# EasyEDA Pro project ProPrj_WatcheRobot2.0openSource_2026-06-17.epro, schematic 反馈舵机STM32控制板原理图
Assembly Variant: Basic; Board Name: Board1; Create Date: 2026-06-17; Page Name: P1; Project Name: WatcheRobot2.0; Schematic Name: Schematic3; Update Date: 2026-06-17; Company: 嘉立创EDA; Page Size: A4; Version: V1.0
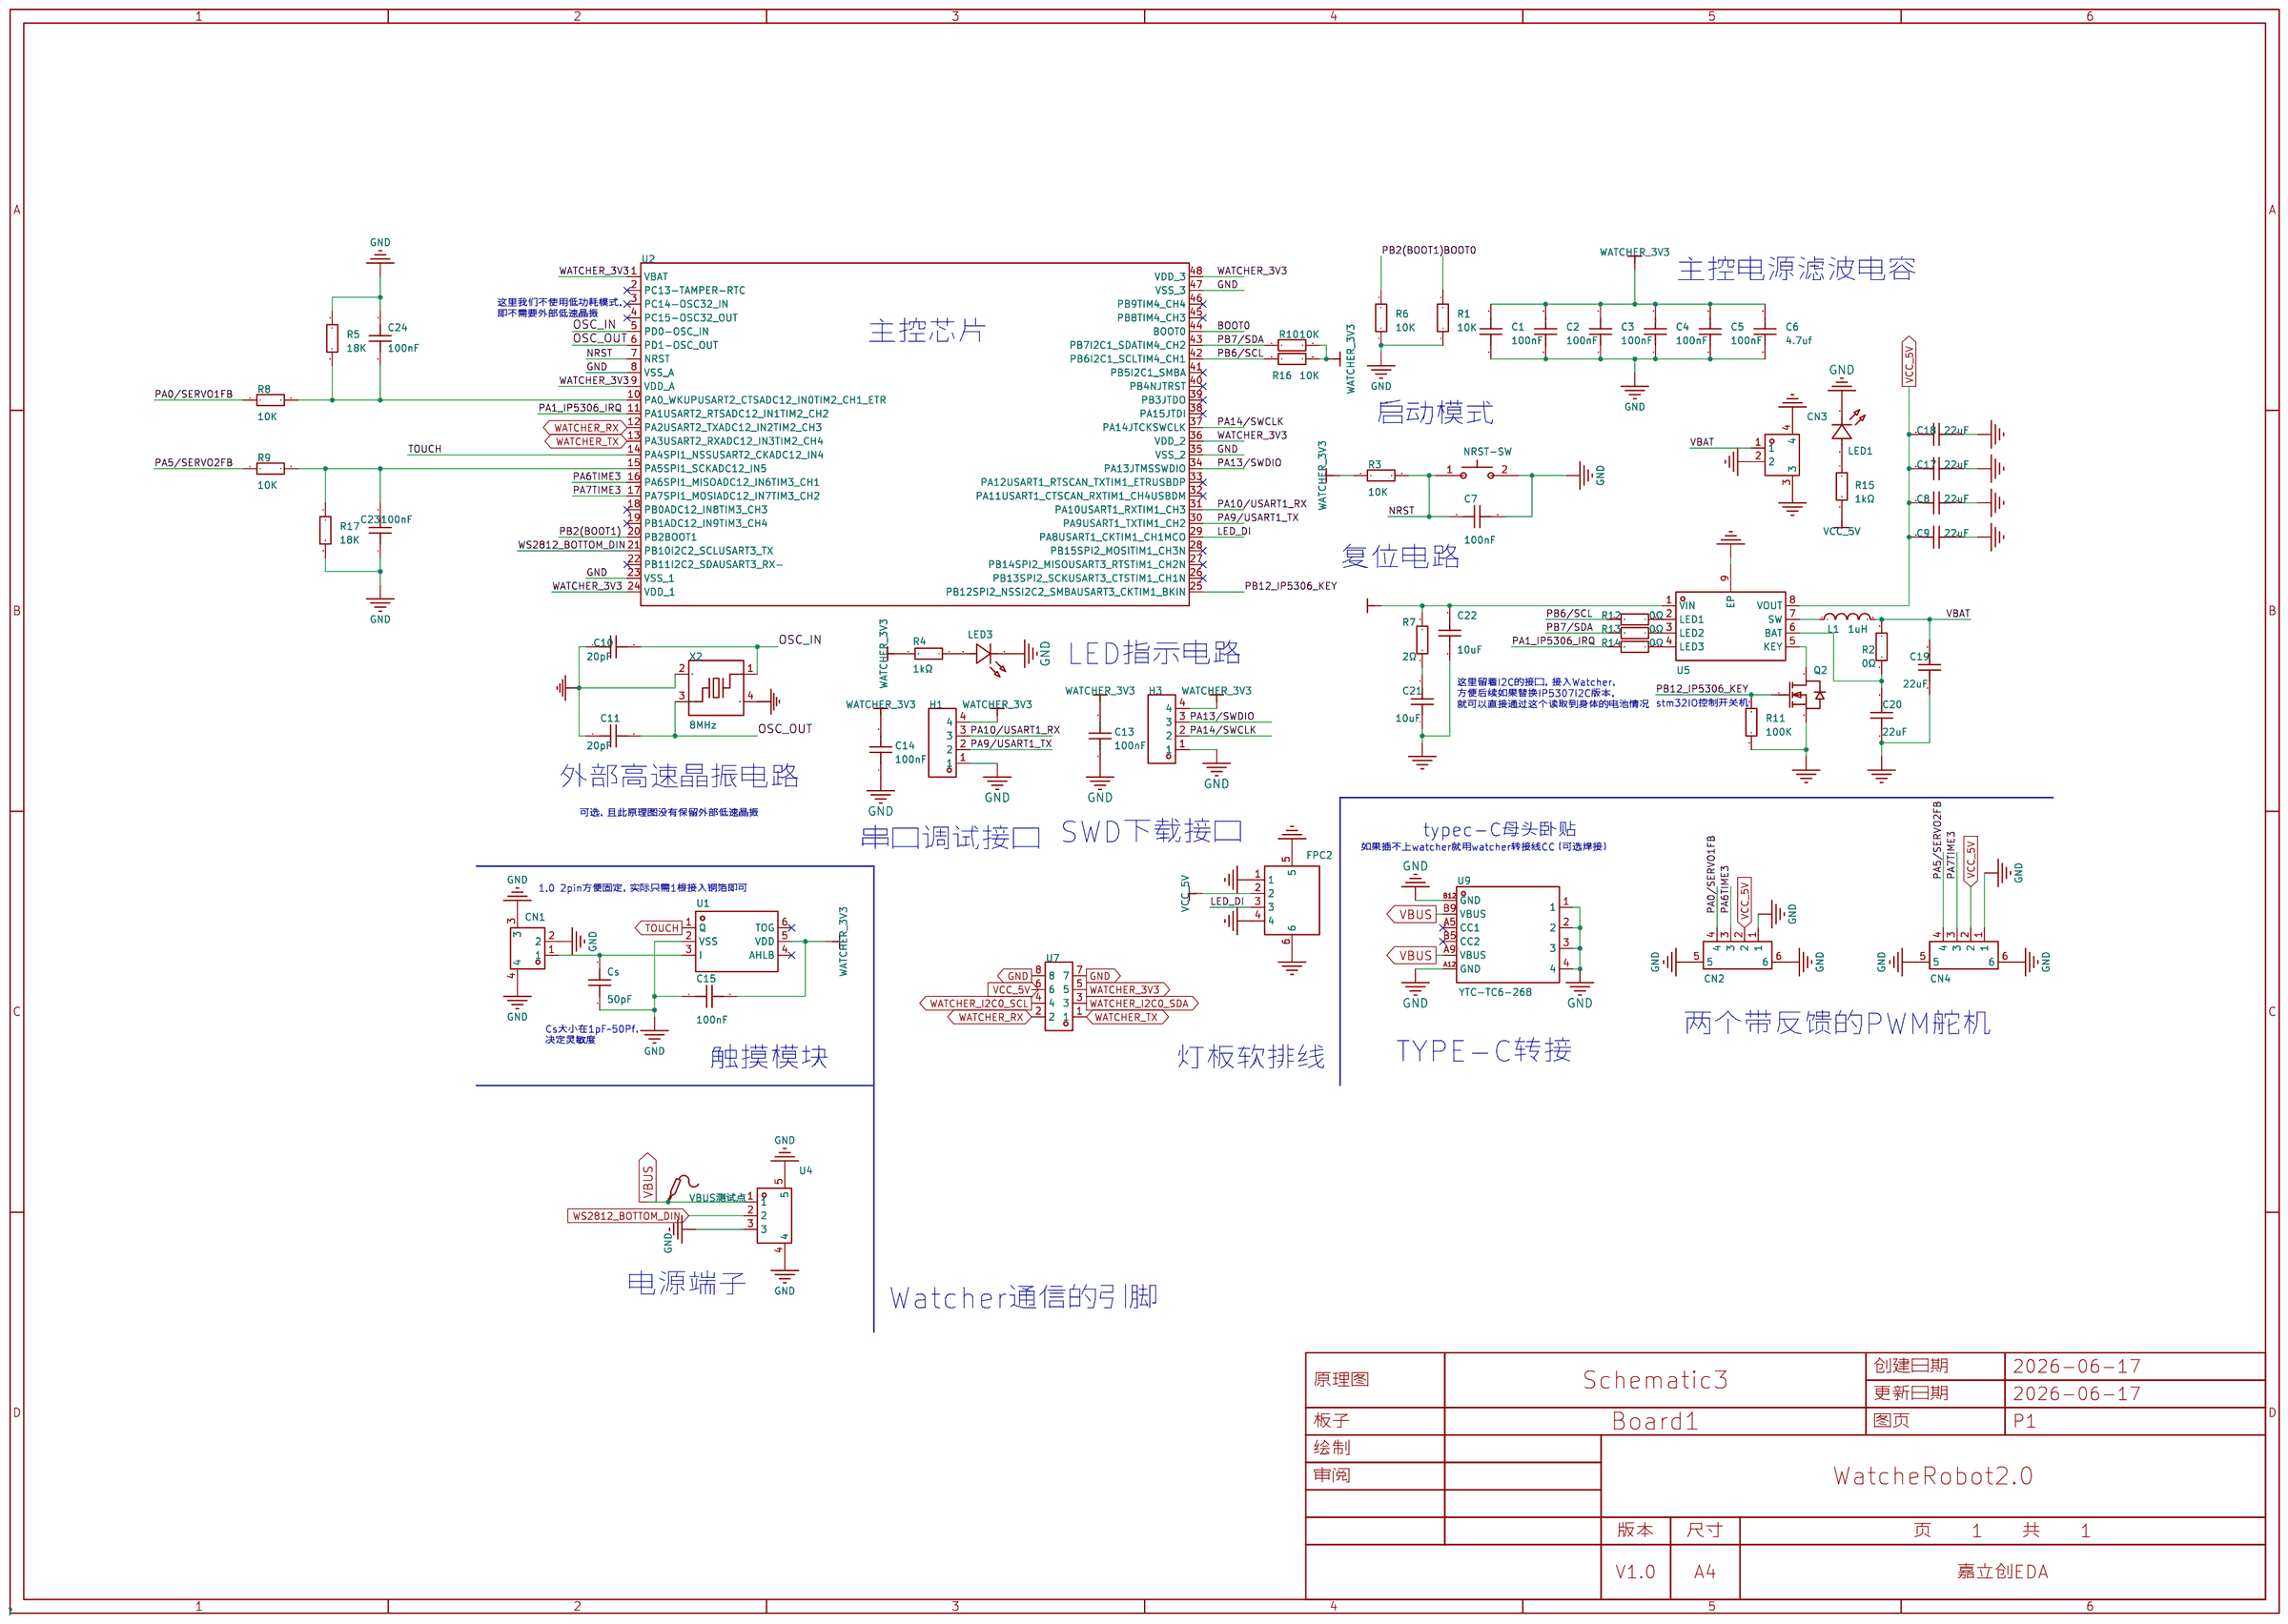
[diagram p3: schematic sheet]

## Parts
C1  100nF  [C0603]
C2  100nF  [C0603]
C3  100nF  [C0603]
C4  100nF  [C0603]
C5  100nF  [C0603]
C6  4.7uf  [C0603]
C7  100nF  [C0603]
C8  22uF  [C0603]
C9  22uF  [C0603]
C10  20pF  [C0603]
C11  20pF  [C0603]
C13  100nF  [C0603]
C14  100nF  [C0603]
C15  100nF  [C0603]
C17  22uF  [C0603]
C18  22uF  [C0603]
C19  22uF  [C0603]
C20  22uF  [C0603]
C21  10uF  [C0603]
C22  10uF  [C0603]
C23  100nF  [C0603]
C24  100nF  [C0603]
CN1  SH1.0mm立式  [CONN-SMD_2P-P1.00_HC-1.0-2PLT]
CN2  SH-MX1.25-4PLT  [CONN-SMD_4P-P1.25_SH-MX1.25-4PLT]
CN3  SH1.0mm立式  [CONN-SMD_2P-P1.00_HC-1.0-2PLT]
CN4  SH-MX1.25-4PLT  [CONN-SMD_4P-P1.25_SH-MX1.25-4PLT]
Cs  50pF  [C0603]
FPC2  FPC4_1mm(下接)  [FPC-SMD_4P-P1.00_C9900022405]
H1  PZ254V-11-04P  [HDR-TH_4P-P2.54-V-M]
H3  PZ254V-11-04P  [HDR-TH_4P-P2.54-V-M]
L1  1uH  [IND-SMD_L4.4-W4.2]
LED1  XL-1608UGC-04  [LED0603-RD_GREEN]
LED3  XL-1608UGC-04  [LED0603-RD_GREEN]
NRST-SW  1TS002C-2300-4300-CT  [SW-SMD_L6.0-W3.5-LS8.0-EH]
Q2  2N7002  [SOT-23-3_L2.9-W1.3-P1.90-LS2.4-BR]
R1  10K  [R0603]
R2  0Ω  [R0603]
R3  10K  [R0603]
R4  1kΩ  [R0402]
R5  18K  [R0603]
R6  10K  [R0603]
R7  2Ω  [R0603]
R8  10K  [R0603]
R9  10K  [R0603]
R10  10K  [R0603]
R11  100K  [R0603]
R12  0Ω  [R0603]
R13  0Ω  [R0603]
R14  0Ω  [R0603]
R15  1kΩ  [R0402]
R16  10K  [R0603]
R17  18K  [R0603]
U1  TTP223E-BA6  [SOT-23-6_L2.9-W1.6-P0.95-LS2.8-BR]
U2  STM32F103CBT6  [LQFP-48_L7.0-W7.0-P0.50-LS9.0-BL]
U4  ZX-SH1.0-3PLT  [CONN-SMD_3P-P1.00_HDGC_HDGC1002WV-S-3P]
U5  IP5306  [ESOP-8_L4.9-W3.9-P1.27-LS6.0-BL-EP]
U7  PZ2.54-2*4  [HDR-TH_8P-P2.54-V-M-R2-C4-S2.54]
U9  YTC-TC6-268  [TYPE-C-SMD_YIYUAN_YTC-TC6-268]
VBUS测试点  -  [Test-Point-0.5mm]
X2  8MHz  [CRYSTAL-SMD_4P-L3.2-W2.5-BL]

## Library data of the parts
C1-C7 C10 C11 C13-C15 C23 C24 = CAP_0603: Supplier Footprint: 0603
C8 C9 C17-C20 = CGA0603X5R226M100JT: 容值:22uF;精度:±20%;额定电压:10V;温度系数:X5R;; LCSC Part Name: 22uF ±20% 10V; Supplier Part: C6119863; Manufacturer: HRE(芯声); Supplier Footprint: 0603; JLCPCB Part Class: 扩展库; Datasheet: https://item.szlcsc.com/datasheet/CGA0603X5R226M100JT/7062569.html; Supplier: LCSC; Tolerance: ±20%; Voltage Rating: 10V; Temperature Coefficient: X5R; Check: false
C21 C22 = CGA0603X5R106K100JT: 容值:10uF;精度:±10%;额定电压:10V;温度系数:X5R;; LCSC Part Name: 10uF ±10% 10V; Supplier Part: C6119842; Manufacturer: HRE(芯声); Supplier Footprint: 0603; JLCPCB Part Class: 扩展库; Datasheet: https://item.szlcsc.com/datasheet/CGA0603X5R106K100JT/7062548.html; Supplier: LCSC; Tolerance: ±10%; Voltage Rating: 10V; Temperature Coefficient: X5R; Check: false
CN1 CN3 = SH1.0mm立式: Supplier Part: C9900005667; Supplier Footprint: SH1.0-2P; JLCPCB Part Class: Extended Part; Supplier: LCSC
CN2 CN4 = SH-MX1.25-4PLT: 插针结构:1x4P;间距:1.25mm;安装方式:立贴;总PIN数:4P;排数:1;每排PIN数:4;额定电流:1A;触头材质:黄铜;触头镀层:锡;工作温度:-25℃~+70℃;; LCSC Part Name: 1x4P 间距:1.25mm 立贴; Supplier Part: C53477387; Manufacturer: SHOU HAN(首韩); Supplier Footprint: SMD,P=1.25mm; JLCPCB Part Class: Extended Part; Datasheet: https://item.szlcsc.com/datasheet/SH-MX1.25-4PLT/56654835.html; Supplier: LCSC; Pins Structure: 1x4P; Pitch: 1.25mm; Mounting Type: 立贴; Number of Pins: 4P; Number of Rows: 1; Number of PINs Per Row: 4; Current Rating: 1A; Contact Material: 黄铜; Contact Plating: 锡; Operating Temperature: -25℃~+70℃; Voltage Rating: 125V; Plastic Material: LCP; Flame Retardant Rating: UL94V-0; Z-Height of the Board: 4.65mm; X-Length of Bottom Edge on Board (Spacing Line): 10mm; Y-Width of Bottom Edge on Board: 4.3mm
Cs = TCC0603COG500J500CT: 容值:50pF;精度:±5%;额定电压:50V;温度系数:C0G;; LCSC Part Name: 50pF ±5% 50V; Supplier Part: C376792; Manufacturer: CCTC(三环); Supplier Footprint: 0603; JLCPCB Part Class: Extended Part; Datasheet: https://item.szlcsc.com/datasheet/TCC0603COG500J500CT/349151.html; Supplier: LCSC; Tolerance: ±5%; Voltage Rating: 50V; Temperature Coefficient: C0G
FPC2 = FPC4_1mm(下接): Supplier Part: C9900022405; Supplier Footprint: FPC-SMD_4P-P1.00; JLCPCB Part Class: Extended Part; Supplier: LCSC
H1 H3 = PZ254V-11-04P: 插针结构:1x4P;间距:2.54mm;行距:-;圆针/方针:方针;安装方式:直插;排数:单排;总PIN位数:4P;额定电流:3A;额定电压:250V;配合针长度:6mm;塑高:2.5mm;端接针长度:3mm;触头材质:-;工作温度:-40℃~+105℃;颜色:黑色;; LCSC Part Name: 1x4P 间距:2.54mm 方针 直插; Supplier Part: C2691448; Manufacturer: XFCN(兴飞); Supplier Footprint: 插件,P=2.54mm; JLCPCB Part Class: Extended Part; Datasheet: https://item.szlcsc.com/datasheet/PZ254V-11-04P/2801085.html; Supplier: LCSC; Pin Structure: 1x4P; Pitch: 2.54mm; Circluar Pins/Square Pins: 方针; Mounting Type: 直插; Number of Rows: 单排; Number of Pins: 4P; Current Rating: 3A; Voltage Rating (Max): 250V; Length of Mating Pin: 6mm; Insulation Height: 2.5mm; Length of End Connection Pin: 3mm; Operating Temperature: -40℃~+105℃; Color: 黑色
L1 = FXL0420-1R0-M: 电感值:1uH;精度:±20%;额定电流:6A;饱和电流(Isat):7A;类型:一体成型电感;; LCSC Part Name: 1uH ±20% 7A; Supplier Part: C167203; Manufacturer: cjiang(长江微电); Supplier Footprint: SMD,4.2x4.4mm; JLCPCB Part Class: 扩展库; Datasheet: https://atta.szlcsc.com/upload/public/pdf/source/20240426/3189EA8206330E2108542F9E34E540E7.pdf; Supplier: LCSC; Tolerance: ±20%; Rated Current: 6A; Saturation Current (Isat): 7A; DC Resistance (DCR): 27mΩ; Type: 一体成型电感; Check: false
LED1 LED3 = XL-1608UGC-04: 灯头类型:-;发光颜色:翠绿色;正向压降(Vf):3.3V;功率:70mW;正向电流:20mA;波长:515nm~535nm;二极管配置:独立二极管;透镜颜色:无色透明透镜;色温:-;发光强度:810mcd;发光角度:120°;载带方式:正贴;工作温度:-40℃~+85℃;; LCSC Part Name: 0603翠绿贴片式发光二极管; Supplier Part: C965804; Manufacturer: XINGLIGHT(成兴光); Supplier Footprint: 0603; JLCPCB Part Class: Extended Part; Datasheet: https://item.szlcsc.com/datasheet/XL-1608UGC-04/1051413.html; Supplier: LCSC; Illumination Color: 翠绿色; Voltage - Forward(Vf): 3.3V; Power(Watts): 70mW; Forward Current: 20mA; Wavelength - Dominant: 515nm~535nm; Peak Wavelength: 525nm; Diode Configuration: 独立二极管; Lens Color: 无色透明透镜; Luminous Intensity: 810mcd; Viewing Angle: 120°; Mounting Style: 正贴; Operating Temperature: -40℃~+85℃
NRST-SW = 1TS002C-2300-4300-CT: 电路结构:单刀单掷;按钮形状:矩形按钮;作用力:2.3N;安装方式:立贴;开关长度:6mm;开关宽度:3.5mm;开关高度:4.3mm;带支架:不带支架;触点电流:50mA;额定电压:12V;带灯:无;工作寿命:3万次;; LCSC Part Name: 6*3.5*4.3mm 立贴 轻触开关; Supplier Part: C319340; Manufacturer: HYP(鸿源精密); Supplier Footprint: SMD,6x3.5mm; JLCPCB Part Class: Extended Part; Datasheet: https://item.szlcsc.com/datasheet/1TS002C-2300-4300-CT/300339.html; Supplier: LCSC; Circuit: 单刀单掷; Actuator Style: 矩形按钮; Operating Force: 2.3N; Mounting Type: 立贴; Length: 6mm; Width: 3.5mm; Switch Height: 4.3mm; with Bracket: 不带支架; Contact Current: 50mA; Voltage Rating: 12V; Actuator/Cap Color: 白色; With Lamp: 无; Termination Style: 鸥翼型; Life: 3万次; Operating Temperature: -40℃~+90℃
Q2 = 2N7002: 数量:1个N沟道;漏源电压(Vdss):60V;连续漏极电流(Id):115mA;导通电阻(RDS(on)):7.5Ω@10V,500mA;耗散功率(Pd):200mW;阈值电压(Vgs(th)):2.5V;; LCSC Part Name: 1个N沟道 耐压:60V 电流:115mA; Supplier Part: C727149; Manufacturer: TWGMC(迪嘉); Supplier Footprint: SOT-23; JLCPCB Part Class: Extended Part; Datasheet: https://item.szlcsc.com/datasheet/2N7002/774254.html; Supplier: LCSC; Number: 1个N沟道; Drain to Source Voltage: 60V; Current - Continuous Drain(Id): 115mA; RDS(on): 7.5Ω@10V,500mA; Pd - Power Dissipation: 200mW; Gate Threshold Voltage (Vgs(th)): 2.5V; Input Capacitance(Ciss): 50pF@25V; Reverse Transfer Capacitance (Crss@Vds): 5pF@25V; Operating Temperature: -55℃~+150℃
R1 R3 R5 R6 R8-R11 R16 R17 = Res_0603: Supplier Footprint: 0603
R2 R12-R14 = 0603WAF0000T5E: 电阻类型:厚膜电阻;阻值:0Ω;精度:±1%;功率:100mW;工作电压:75V;温度系数:-;; LCSC Part Name: 0Ω ±1% 100mW 厚膜电阻; Supplier Part: C21189; Manufacturer: UNI-ROYAL(厚声); Supplier Footprint: 0603; JLCPCB Part Class: 基础库; Datasheet: https://item.szlcsc.com/datasheet/0603WAF0000T5E/21903.html; Supplier: LCSC; Type: 厚膜电阻; Tolerance: ±1%; Power(Watts): 100mW; Voltage-Supply(Max): 75V; Operating Temperature: -55℃~+155℃; Check: false
R4 R15 = 0402WGF1001TCE: 电阻类型:厚膜电阻;阻值:1kΩ;精度:±1%;功率:62.5mW;最大工作电压:50V;温度系数:±100ppm/℃;; LCSC Part Name: 1kΩ ±1% 62.5mW 厚膜电阻; Supplier Part: C11702; Manufacturer: UNI-ROYAL(厚声); Supplier Footprint: 0402; JLCPCB Part Class: 基础库; Datasheet: https://atta.szlcsc.com/upload/public/pdf/source/20200306/C422600_1E6D84923E4A46A82E41ADD87F860B5C.pdf; Supplier: LCSC; Type: 厚膜电阻; Tolerance: ±1%; Power(Watts): 62.5mW; Overload Voltage (Max): 50V; Temperature Coefficient: ±100ppm/℃; Operating Temperature Range: -55℃~+155℃
R7 = 0603WAF200KT5E: 电阻类型:厚膜电阻;阻值:2Ω;精度:±1%;功率:100mW;工作电压:75V;温度系数:±200ppm/℃;; LCSC Part Name: 2Ω ±1% 100mW 厚膜电阻; Supplier Part: C22977; Manufacturer: UNI-ROYAL(厚声); Supplier Footprint: 0603; JLCPCB Part Class: 基础库; Datasheet: https://item.szlcsc.com/datasheet/0603WAF200KT5E/23704.html; Supplier: LCSC; Type: 厚膜电阻; Tolerance: ±1%; Power(Watts): 100mW; Voltage-Supply(Max): 75V; Temperature Coefficient: ±200ppm/℃; Operating Temperature: -55℃~+155℃; Check: false
U1 = TTP223E-BA6: 单按键触摸感应开关; LCSC Part Name: 停产; Supplier Part: C129457; Manufacturer: TONTEK(通泰); Supplier Footprint: SOT-23-6; JLCPCB Part Class: Extended Part; Datasheet: https://atta.szlcsc.com/upload/public/pdf/source/20170914/C129457_1505360037116968239.pdf; Supplier: LCSC
U2 = STM32F103CBT6: CPU内核:ARM-M3;CPU最大主频:72MHz;应用领域:-;; LCSC Part Name: 主流增强型ARM Cortex-M3 MCU，具有128 KB Flash、72 MHz CPU、电机控制、USB和CAN; Supplier Part: C8304; Manufacturer: ST(意法半导体); Supplier Footprint: LQFP-48(7x7); JLCPCB Part Class: Extended Part; Datasheet: https://item.szlcsc.com/datasheet/STM32F103CBT6/8796.html; Supplier: LCSC; CPU Core: ARM-M3; CPU Maximum Speed: 72MHz; Program Storage Size: 128KB; Program Memory Type: FLASH; Number of I/O: 37; ADC (Bit): 12bit; Voltage - Supply: 2V~3.6V
U4 = ZX-SH1.0-3PLT: 插针结构:1x3P;间距:1mm;安装方式:立贴;参考系列:SH;总PIN数:3P;排数:1;每排PIN数:3;行距:-;额定电流:1A;触头材质:黄铜;触头镀层:锡;工作温度:-40℃~+85℃;; LCSC Part Name: 1x3P 间距:1mm 立贴 系列:SH; Supplier Part: C7430452; Manufacturer: Megastar(兆星); Supplier Footprint: SMD,P=1mm; JLCPCB Part Class: Extended Part; Datasheet: https://item.szlcsc.com/datasheet/ZX-SH1.0-3PLT/8430321.html; Supplier: LCSC; Pins Structure: 1x3P; Pitch: 1mm; Mounting Type: 立贴; Reference Series: SH; Number of Pins: 3P; Number of Rows: 1; Number of PINs Per Row: 3; Current Rating: 1A; Contact Material: 黄铜; Contact Plating: 锡; Operating Temperature: -40℃~+85℃; Voltage Rating: 50V; Plastic Material: LCP; Supplementary Features: 辅助焊脚; Color: 米色; Z-Height of the Board: 4.4mm; X-Length of Bottom Edge on Board (Spacing Line): 5.35mm; Y-Width of Bottom Edge on Board: 3.05mm
U5 = IP5306: 2.1A充电2.4A放电高集成度移动电源SOC; Supplier Part: C181692; Manufacturer: INJOINIC(英集芯); Supplier Footprint: ESOP-8; JLCPCB Part Class: 扩展库; Datasheet: https://atta.szlcsc.com/upload/public/pdf/source/20190627/C384572_9925B3DDC4041BC6108E5AB46A2A0AB1.pdf; Supplier: LCSC
U7 = PZ2.54-2*4: 插针结构:2x4P;间距:2.54mm;行距:2.54mm;圆针/方针:方针;安装方式:直插;排数:双排;总PIN位数:8P;额定电流:2.5A;配合针长度:6mm;塑高:2.54mm;端接针长度:3mm;触头材质:黄铜;触头镀层:金;工作温度:-40℃~+105℃;; LCSC Part Name: 2x4P 间距:2.54mm 方针 直插; Supplier Part: C5156676; Manufacturer: ZHOURI(洲日); Supplier Footprint: 插件,P=2.54mm; JLCPCB Part Class: Extended Part; Datasheet: https://item.szlcsc.com/datasheet/PZ2.54-2*4/5790845.html; Supplier: LCSC; Pin Structure: 2x4P; Pitch: 2.54mm; Row Spacing: 2.54mm; Circluar Pins/Square Pins: 方针; Mounting Type: 直插; Number of Rows: 双排; Number of Pins: 8P; Current Rating: 2.5A; Length of Mating Pin: 6mm; Insulation Height: 2.54mm; Length of End Connection Pin: 3mm; Contact Material: 黄铜; Contact Plating: 金; Operating Temperature: -40℃~+105℃
U9 = YTC-TC6-268: 连接器类型:Type-C;公母:母座;触点数量:6;; LCSC Part Name: Type-C 母座; Supplier Part: C5260484; Manufacturer: YIYUAN(怡远); Supplier Footprint: SMD; JLCPCB Part Class: 扩展库; Datasheet: https://atta.szlcsc.com/upload/public/pdf/source/20221115/94102468E8C367463F1D717839C68408.pdf; Supplier: LCSC; Connector Type: Type-C; Gender: 母座; Number of Contacts: 6
VBUS测试点 = Test-Point: Test Point 测试点
X2 = X32258MOB4SI: 晶振类型:贴片晶振;频率:8MHz;常温频差:±10ppm;负载电容:12pF;频率稳定度:±20ppm;; LCSC Part Name: YSX321SL 8MHZ 4P 3225 12PF ±10PPM -40~85℃ (±20PPM); Supplier Part: C2682775; Manufacturer: YXC(扬兴晶振); Supplier Footprint: SMD3225-4P; JLCPCB Part Class: Extended Part; Datasheet: https://item.szlcsc.com/datasheet/X32258MOB4SI/2777872.html; Supplier: LCSC; Type: 贴片晶振; Normal temperature Frequency Tolerance: ±10ppm; Load Capacitance: 12pF; Frequency Stability: ±20ppm; Equivalent Series Resistance(ESR): 150Ω; Operating Temperature: -40℃~+85℃

## Nets
GND: C1.1 C2.1 C3.1 C4.1 C5.1 C6.1 C7.2 C8.1 C9.1 C10.1 C11.1 C13.1 C14.1 C15.1 C17.1 C18.1 C19.1 C20.1 C21.1 C22.1 C23.1 C24.1 CN1.2 CN1.3 CN1.4 CN2.1 CN2.5 CN2.6 CN3.2 CN3.3 CN3.4 CN4.1 CN4.5 CN4.6 Cs.1 FPC2.1 FPC2.4 FPC2.5 FPC2.6 H1.1 H3.1 LED1.1(K) LED3.1(K) NRST-SW.2(B) Q2.2(S) R1.1 R5.1 R6.1 R11.1 R17.2 U1.2(VSS) U2.8(VSS_A) U2.23(VSS_1) U2.35(VSS_2) U2.47(VSS_3) U4.3 U4.4 U4.5 U5.9(EP) U7.7 U7.8 U9.1 U9.2 U9.3 U9.4 U9.A12(GND) U9.B12(GND) X2.2(GND) X2.4(GND)
VBAT: C19.2 CN3.1 L1.2 R2.2
VBUS: C22.2 R7.2 U4.1 U5.1(VIN) U9.A9(VBUS) U9.B9(VBUS) VBUS测试点.1
VCC_5V: C8.2 C9.2 C17.2 C18.2 CN2.2 CN4.2 FPC2.2 R15.2 U5.8(VOUT) U7.6
BOOT0: R1.2 U2.44(BOOT0)
LED_DI: FPC2.3 U2.29(PA8USART1_CKTIM1_CH1MCO)
NRST: C7.1 NRST-SW.1(A) R3.2 U2.7(NRST)
OSC_IN: C10.2 U2.5(PD0-OSC_IN) X2.1
OSC_OUT: C11.2 U2.6(PD1-OSC_OUT) X2.3
PA0/SERVO1FB: CN2.4 R8.1
PA1_IP5306_IRQ: R14.2 U2.11(PA1USART2_RTSADC12_IN1TIM2_CH2)
PA5/SERVO2FB: CN4.4 R9.1
PA6TIME3: CN2.3 U2.16(PA6SPI1_MISOADC12_IN6TIM3_CH1)
PA7TIME3: CN4.3 U2.17(PA7SPI1_MOSIADC12_IN7TIM3_CH2)
PA9/USART1_TX: H1.2 U2.30(PA9USART1_TXTIM1_CH2)
PA10/USART1_RX: H1.3 U2.31(PA10USART1_RXTIM1_CH3)
PA13/SWDIO: H3.3 U2.34(PA13JTMSSWDIO)
PA14/SWCLK: H3.2 U2.37(PA14JTCKSWCLK)
PB2(BOOT1): R6.2 U2.20(PB2BOOT1)
PB6/SCL: R12.2 R16.1 U2.42(PB6I2C1_SCLTIM4_CH1)
PB7/SDA: R10.1 R13.2 U2.43(PB7I2C1_SDATIM4_CH2)
PB12_IP5306_KEY: Q2.1(G) R11.2 U2.25(PB12SPI2_NSSI2C2_SMBAUSART3_CKTIM1_BKIN)
TOUCH: U1.1(Q) U2.14(PA4SPI1_NSSUSART2_CKADC12_IN4)
WATCHER_3V3: C1.2 C2.2 C3.2 C4.2 C5.2 C6.2 C13.2 C14.2 C15.2 H1.4 H3.4 R3.1 R4.2 R10.2 R16.2 U1.5(VDD) U2.1(VBAT) U2.9(VDD_A) U2.24(VDD_1) U2.36(VDD_2) U2.48(VDD_3) U7.5
WATCHER_I2C0_SCL: U7.4
WATCHER_I2C0_SDA: U7.3
WATCHER_RX: U2.12(PA2USART2_TXADC12_IN2TIM2_CH3) U7.2
WATCHER_TX: U2.13(PA3USART2_RXADC12_IN3TIM2_CH4) U7.1
WS2812_BOTTOM_DIN: U2.21(PB10I2C2_SCLUSART3_TX) U4.2
$1N35: C23.2 R9.2 R17.1 U2.15(PA5SPI1_SCKADC12_IN5)
$1N37: C24.2 R5.2 R8.2 U2.10(PA0_WKUPUSART2_CTSADC12_IN0TIM2_CH1_ETR)
$1N45: R14.1 U5.4(LED3)
$1N46: R13.1 U5.3(LED2)
$1N47: R12.1 U5.2(LED1)
$1N54: Q2.3(D) U5.5(KEY)
$1N57: LED1.2(A) R15.1
$1N58: LED3.2(A) R4.1
$1N85: CN1.1 Cs.2 U1.3(I)
$1N117: C21.2 R7.1
$1N124: C20.2 R2.1 U5.6(BAT)
$1N129: L1.1 U5.7(SW)

Not connected (* = marked no-connect by the designer): U1 4(AHLB)* 6(TOG)*; U2 2(PC13-TAMPER-RTC)* 3(PC14-OSC32_IN)* 4(PC15-OSC32_OUT)* 18(PB0ADC12_IN8TIM3_CH3)* 19(PB1ADC12_IN9TIM3_CH4)* 22(PB11I2C2_SDAUSART3_RX-)* 26(PB13SPI2_SCKUSART3_CTSTIM1_CH1N)* 27(PB14SPI2_MISOUSART3_RTSTIM1_CH2N)* 28(PB15SPI2_MOSITIM1_CH3N)* 32(PA11USART1_CTSCAN_RXTIM1_CH4USBDM)* 33(PA12USART1_RTSCAN_TXTIM1_ETRUSBDP)* 38(PA15JTDI)* 39(PB3JTDO)* 40(PB4NJTRST)* 41(PB5I2C1_SMBA)* 45(PB8TIM4_CH3)* 46(PB9TIM4_CH4)*; U9 A5(CC1)* B5(CC2)*

## Notes on the sheet
- 主控电源滤波电容
- 这里我们不使用低功耗模式，
  即不需要外部低速晶振
- 主控芯片
- 启动模式
- 复位电路
- LED指示电路
- 这里留着I2C的接口，接入Watcher，
  方便后续如果替换IP5307I2C版本，
  就可以直接通过这个读取到身体的电池情况
- stm32IO控制开关机
- 外部高速晶振电路
- 可选，且此原理图没有保留外部低速晶振
- typec-C母头卧贴
- 串口调试接口
- SWD下载接口
- 如果插不上watcher就用watcher转接线CC（可选焊接）
- 1.0 2pin方便固定，实际只需1根接入铜箔即可
- Cs大小在1pF~50Pf，
  决定灵敏度
- 两个带反馈的PWM舵机
- TYPE-C转接
- 触摸模块
- 灯板软排线
- 电源端子
- Watcher通信的引脚
